# Altium schematic sheet communication.SchDoc
size A4
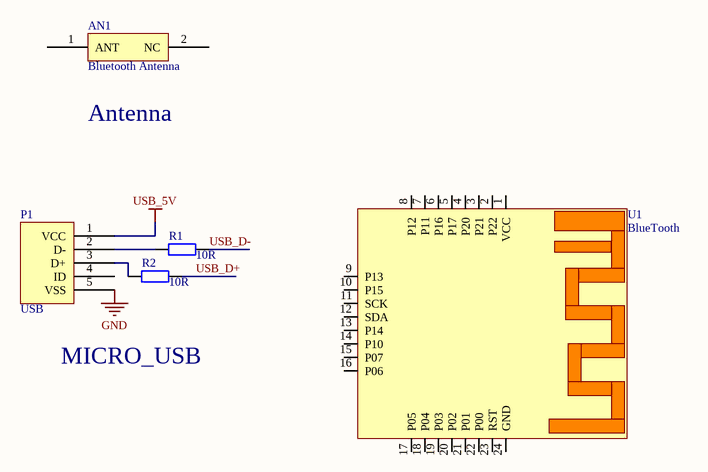
[diagram p0: communication.SchDoc]

## Parts
AN1  Bluetooth Antenna  [AN9520]
P1  USB  [USB_MICRO_M]
R1  value 10R  [R-0603]  (hidden comment: Res2)
R2  value 10R  [AXIAL-0.4]  (hidden comment: Res2)
U1  BlueTooth  [BLE_CC2541]

## Nets
GND: P1.5(VSS)
USB_5V: P1.1(VCC)
USB_D+: R2.2
USB_D-: R1.2
NetP1_2: P1.2(D-) R1.1
NetP1_3: P1.3(D+) R2.1

Not connected (* = marked no-connect by the designer): AN1 1(ANT) 2(NC); P1 4(ID); U1 1(VCC) 2(P22) 3(P21) 4(P20) 5(P17) 6(P16) 7(P11) 8(P12) 9(P13) 10(P15) 11(SCK) 12(SDA) 13(P14) 14(P10) 15(P07) 16(P06) 17(P05) 18(P04) 19(P03) 20(P02) 21(P01) 22(P00) 23(RST) 24(GND)

## Notes on the sheet
- Antenna
- MICRO_USB

## Library data of the parts
AN1 = AN9520
R1 R2 = Res2: Resistor; Published: 8-Jun-2000; LatestRevisionDate: 17-Jul-2002; LatestRevisionNote: Re-released for DXP Platform.; PackageReference: AXIAL-0.4; Publisher: Altium Limited; PackageDescription: Axial Device, Thru-Hole; 2 Leads; 0.4 in Pin Spacing
U1 = CC2541-MOD